# EAGLE design smallTransBrd (EAGLE 9.1.0)
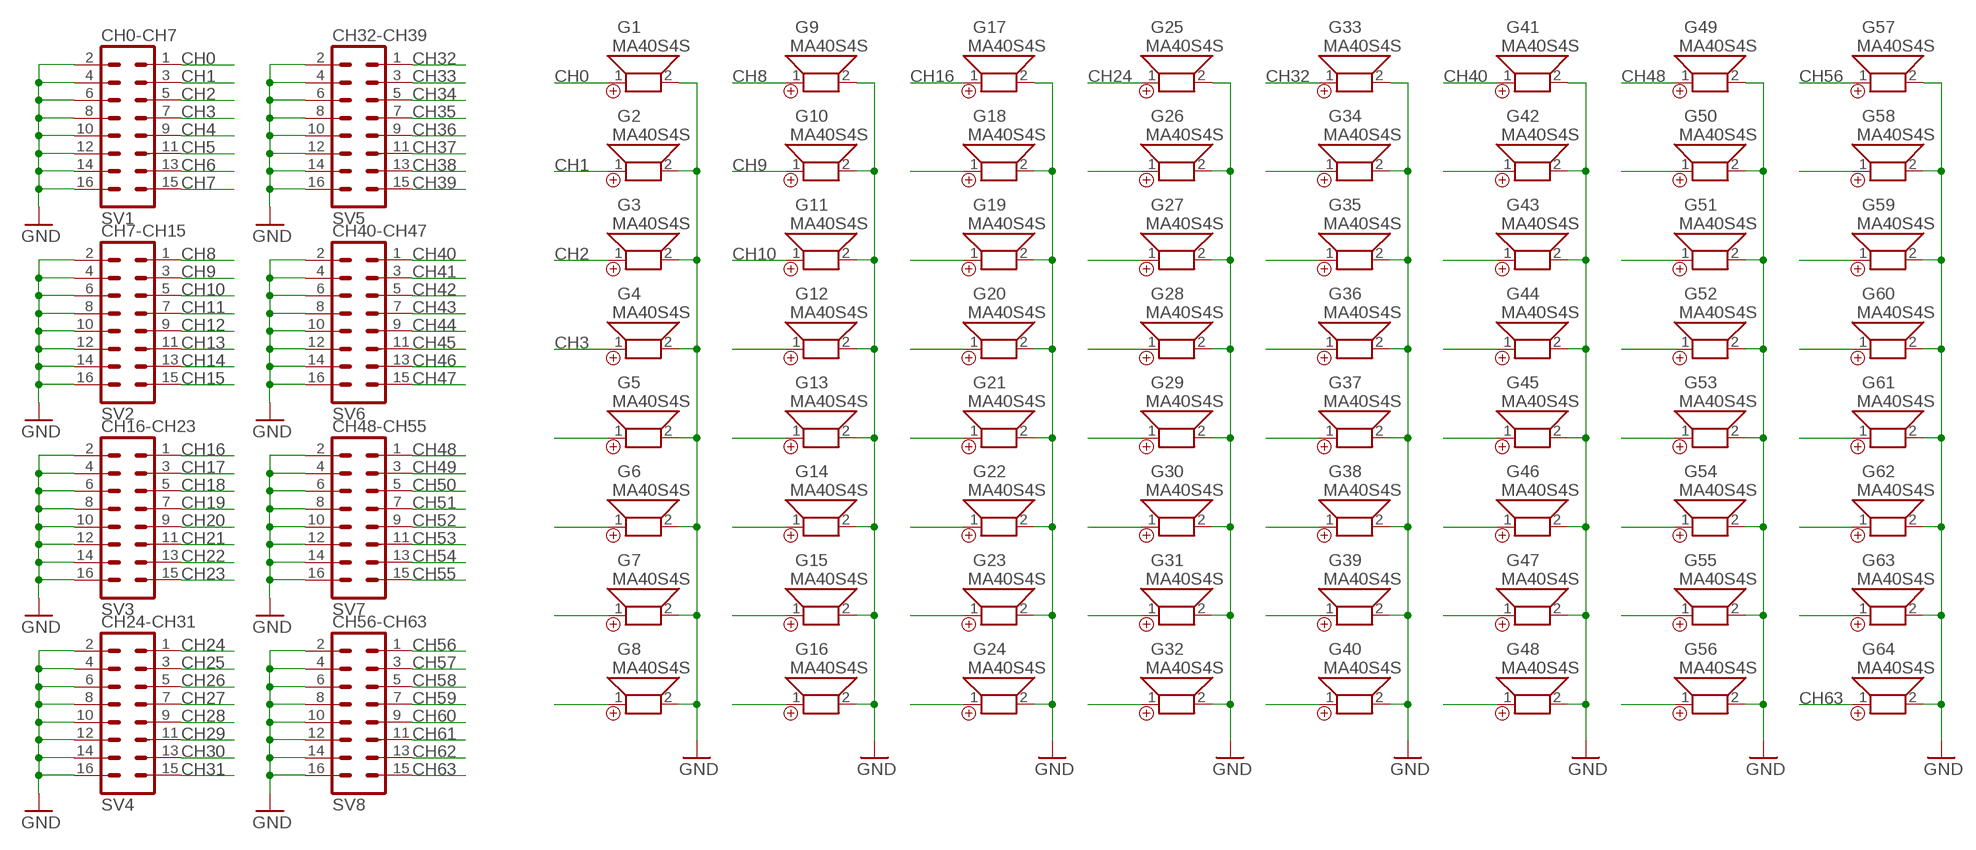
[diagram p0: schematic, sheet 1]

## Parts
G1  MA40S4S  [MA40S4S]
G2  MA40S4S  [MA40S4S]
G3  MA40S4S  [MA40S4S]
G4  MA40S4S  [MA40S4S]
G5  MA40S4S  [MA40S4S]
G6  MA40S4S  [MA40S4S]
G7  MA40S4S  [MA40S4S]
G8  MA40S4S  [MA40S4S]
G9  MA40S4S  [MA40S4S]
G10  MA40S4S  [MA40S4S]
G11  MA40S4S  [MA40S4S]
G12  MA40S4S  [MA40S4S]
G13  MA40S4S  [MA40S4S]
G14  MA40S4S  [MA40S4S]
G15  MA40S4S  [MA40S4S]
G16  MA40S4S  [MA40S4S]
G17  MA40S4S  [MA40S4S]
G18  MA40S4S  [MA40S4S]
G19  MA40S4S  [MA40S4S]
G20  MA40S4S  [MA40S4S]
G21  MA40S4S  [MA40S4S]
G22  MA40S4S  [MA40S4S]
G23  MA40S4S  [MA40S4S]
G24  MA40S4S  [MA40S4S]
G25  MA40S4S  [MA40S4S]
G26  MA40S4S  [MA40S4S]
G27  MA40S4S  [MA40S4S]
G28  MA40S4S  [MA40S4S]
G29  MA40S4S  [MA40S4S]
G30  MA40S4S  [MA40S4S]
G31  MA40S4S  [MA40S4S]
G32  MA40S4S  [MA40S4S]
G33  MA40S4S  [MA40S4S]
G34  MA40S4S  [MA40S4S]
G35  MA40S4S  [MA40S4S]
G36  MA40S4S  [MA40S4S]
G37  MA40S4S  [MA40S4S]
G38  MA40S4S  [MA40S4S]
G39  MA40S4S  [MA40S4S]
G40  MA40S4S  [MA40S4S]
G41  MA40S4S  [MA40S4S]
G42  MA40S4S  [MA40S4S]
G43  MA40S4S  [MA40S4S]
G44  MA40S4S  [MA40S4S]
G45  MA40S4S  [MA40S4S]
G46  MA40S4S  [MA40S4S]
G47  MA40S4S  [MA40S4S]
G48  MA40S4S  [MA40S4S]
G49  MA40S4S  [MA40S4S]
G50  MA40S4S  [MA40S4S]
G51  MA40S4S  [MA40S4S]
G52  MA40S4S  [MA40S4S]
G53  MA40S4S  [MA40S4S]
G54  MA40S4S  [MA40S4S]
G55  MA40S4S  [MA40S4S]
G56  MA40S4S  [MA40S4S]
G57  MA40S4S  [MA40S4S]
G58  MA40S4S  [MA40S4S]
G59  MA40S4S  [MA40S4S]
G60  MA40S4S  [MA40S4S]
G61  MA40S4S  [MA40S4S]
G62  MA40S4S  [MA40S4S]
G63  MA40S4S  [MA40S4S]
G64  MA40S4S  [MA40S4S]
SV1  CH0-CH7  ML16  [ML16]
SV2  CH7-CH15  ML16  [ML16]
SV3  CH16-CH23  ML16  [ML16]
SV4  CH24-CH31  ML16  [ML16]
SV5  CH32-CH39  ML16  [ML16]
SV6  CH40-CH47  ML16  [ML16]
SV7  CH48-CH55  ML16  [ML16]
SV8  CH56-CH63  ML16  [ML16]

## Nets
CH0: G1.1 SV1.1
CH1: G2.1 SV1.3
CH2: G3.1 SV1.5
CH3: G4.1 SV1.7
CH4: G5.1 SV1.9
CH5: G6.1 SV1.11
CH6: G7.1 SV1.13
CH7: G8.1 SV1.15
CH8: G9.1 SV2.1
CH9: G10.1 SV2.3
CH10: G11.1 SV2.5
CH11: G12.1 SV2.7
CH12: G13.1 SV2.9
CH13: G14.1 SV2.11
CH14: G15.1 SV2.13
CH15: G16.1 SV2.15
CH16: G17.1 SV3.1
CH17: G18.1 SV3.3
CH18: G19.1 SV3.5
CH19: G20.1 SV3.7
CH20: G21.1 SV3.9
CH21: G22.1 SV3.11
CH22: G23.1 SV3.13
CH23: G24.1 SV3.15
CH24: G25.1 SV4.1
CH25: G26.1 SV4.3
CH26: G27.1 SV4.5
CH27: G28.1 SV4.7
CH28: G29.1 SV4.9
CH29: G30.1 SV4.11
CH30: G31.1 SV4.13
CH31: G32.1 SV4.15
CH32: G33.1 SV5.1
CH33: G34.1 SV5.3
CH34: G35.1 SV5.5
CH35: G36.1 SV5.7
CH36: G37.1 SV5.9
CH37: G38.1 SV5.11
CH38: G39.1 SV5.13
CH39: G40.1 SV5.15
CH40: G41.1 SV6.1
CH41: G42.1 SV6.3
CH42: G43.1 SV6.5
CH43: G44.1 SV6.7
CH44: G45.1 SV6.9
CH45: G46.1 SV6.11
CH46: G47.1 SV6.13
CH47: G48.1 SV6.15
CH48: G49.1 SV7.1
CH49: G50.1 SV7.3
CH50: G51.1 SV7.5
CH51: G52.1 SV7.7
CH52: G53.1 SV7.9
CH53: G54.1 SV7.11
CH54: G55.1 SV7.13
CH55: G56.1 SV7.15
CH56: G57.1 SV8.1
CH57: G58.1 SV8.3
CH58: G59.1 SV8.5
CH59: G60.1 SV8.7
CH60: G61.1 SV8.9
CH61: G62.1 SV8.11
CH62: G63.1 SV8.13
CH63: G64.1 SV8.15
GND: G1.2 G2.2 G3.2 G4.2 G5.2 G6.2 G7.2 G8.2 G9.2 G10.2 G11.2 G12.2 G13.2 G14.2 G15.2 G16.2 G17.2 G18.2 G19.2 G20.2 G21.2 G22.2 G23.2 G24.2 G25.2 G26.2 G27.2 G28.2 G29.2 G30.2 G31.2 G32.2 G33.2 G34.2 G35.2 G36.2 G37.2 G38.2 G39.2 G40.2 G41.2 G42.2 G43.2 G44.2 G45.2 G46.2 G47.2 G48.2 G49.2 G50.2 G51.2 G52.2 G53.2 G54.2 G55.2 G56.2 G57.2 G58.2 G59.2 G60.2 G61.2 G62.2 G63.2 G64.2 SV1.2 SV1.4 SV1.6 SV1.8 SV1.10 SV1.12 SV1.14 SV1.16 SV2.2 SV2.4 SV2.6 SV2.8 SV2.10 SV2.12 SV2.14 SV2.16 SV3.2 SV3.4 SV3.6 SV3.8 SV3.10 SV3.12 SV3.14 SV3.16 SV4.2 SV4.4 SV4.6 SV4.8 SV4.10 SV4.12 SV4.14 SV4.16 SV5.2 SV5.4 SV5.6 SV5.8 SV5.10 SV5.12 SV5.14 SV5.16 SV6.2 SV6.4 SV6.6 SV6.8 SV6.10 SV6.12 SV6.14 SV6.16 SV7.2 SV7.4 SV7.6 SV7.8 SV7.10 SV7.12 SV7.14 SV7.16 SV8.2 SV8.4 SV8.6 SV8.8 SV8.10 SV8.12 SV8.14 SV8.16

## Library data of the parts
G1-G64 = projectLib:MA40S4S
SV1-SV8 = con-harting-ml:ML16: HARTING; OC_FARNELL: unknown; OC_NEWARK: unknown

## Board
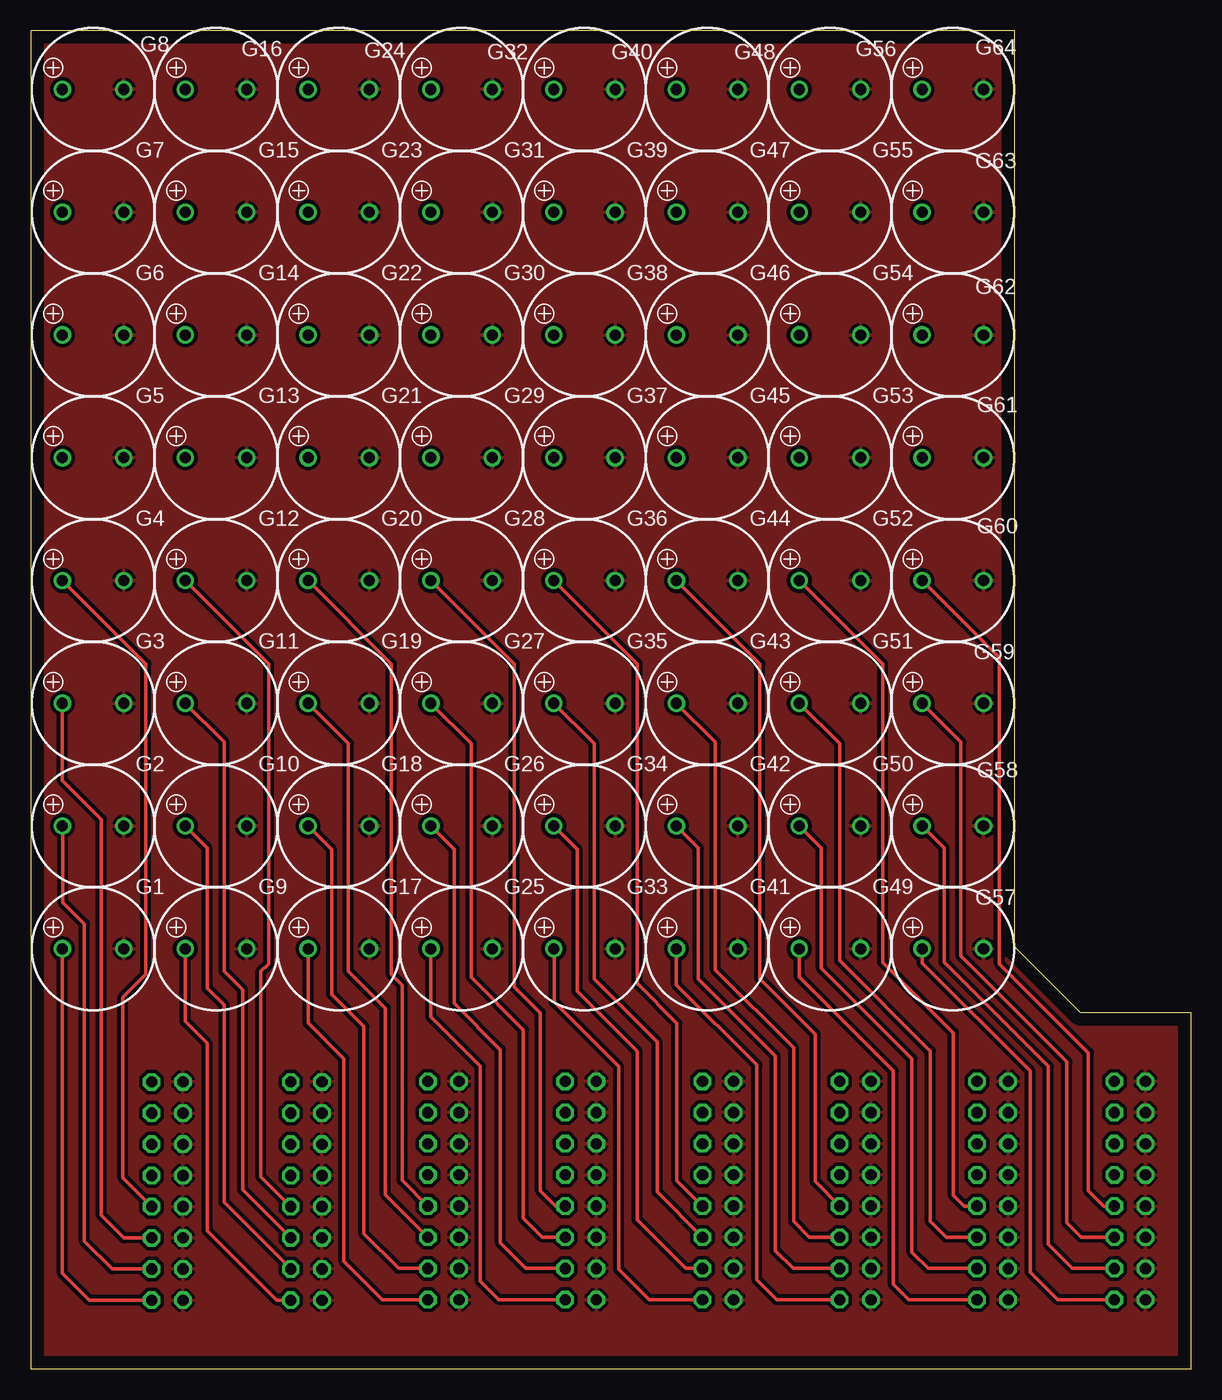
[diagram p1: board, top side]
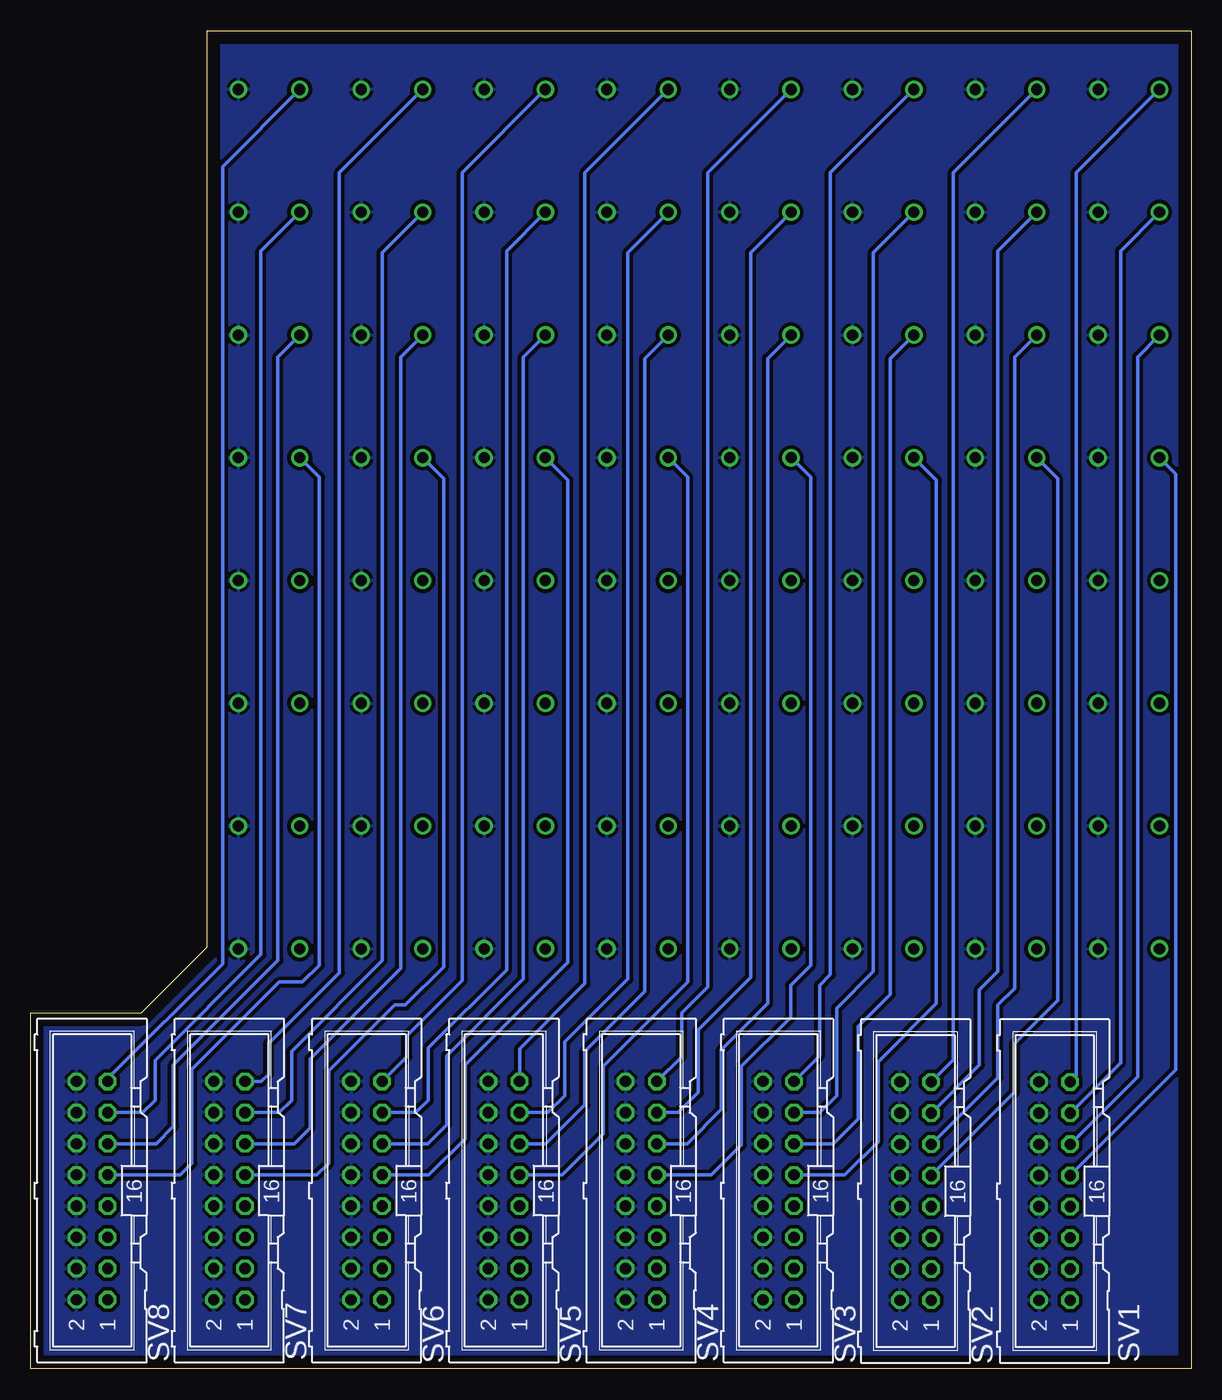
[diagram p2: board, bottom side, seen from below]

Size 94.5 x 109 mm. Coordinates in mm from the lower left corner, seen from the top.
Outline: 0,0 94.5,0 94.5,29 85.5,29 80.12,34.38 80.12,43.38 80.12,109 0,109 0,0
Copper layers (1*16): Top 0.035mm / dielectric 1.5mm / Bottom 0.035mm
Design rules "default *": minimum track width 6mil, minimum drill 0.35mm, track to track 12mil, track to pad 12mil, pad to pad 12mil, via to via 12mil, smd to smd 12mil, copper to edge 40mil, drill to drill 6mil, minimum pad ring 10mil, minimum via ring 8mil, stop-mask expansion 4mil, vias tented up to drill 0mil, thermal gap 10mil

### Footprints (pad centres in the part's own frame; a part is rotated, then mirrored left to right if it is on the bottom)
MA40S4S = drill 0.9: 1 -2.5,0; 2 2.5,0
ML16 = drill 0.914 octagon: 1 -8.89,-1.27; 2 -8.89,1.27; 3 -6.35,-1.27; 4 -6.35,1.27; 5 -3.81,-1.27; 6 -3.81,1.27; 7 -1.27,-1.27; 8 -1.27,1.27; 9 1.27,-1.27; 10 1.27,1.27; 11 3.81,-1.27; 12 3.81,1.27; 13 6.35,-1.27; 14 6.35,1.27; 15 8.89,-1.27; 16 8.89,1.27

### Placement (x,y rotation side)
G1  5.08,34.21 0 top
G2  5.08,44.21 0 top
G3  5.08,54.21 0 top
G4  5.08,64.21 0 top
G5  5.08,74.21 0 top
G6  5.08,84.21 0 top
G7  5.08,94.21 0 top
G8  5.08,104.21 0 top
G9  15.08,34.21 0 top
G10  15.08,44.21 0 top
G11  15.08,54.21 0 top
G12  15.08,64.21 0 top
G13  15.08,74.21 0 top
G14  15.08,84.21 0 top
G15  15.08,94.21 0 top
G16  15.08,104.21 0 top
G17  25.08,34.21 0 top
G18  25.08,44.21 0 top
G19  25.08,54.21 0 top
G20  25.08,64.21 0 top
G21  25.08,74.21 0 top
G22  25.08,84.21 0 top
G23  25.08,94.21 0 top
G24  25.08,104.21 0 top
G25  35.08,34.21 0 top
G26  35.08,44.21 0 top
G27  35.08,54.21 0 top
G28  35.08,64.21 0 top
G29  35.08,74.21 0 top
G30  35.08,84.21 0 top
G31  35.08,94.21 0 top
G32  35.08,104.21 0 top
G33  45.08,34.21 0 top
G34  45.08,44.21 0 top
G35  45.08,54.21 0 top
G36  45.08,64.21 0 top
G37  45.08,74.21 0 top
G38  45.08,84.21 0 top
G39  45.08,94.21 0 top
G40  45.08,104.21 0 top
G41  55.08,34.21 0 top
G42  55.08,44.21 0 top
G43  55.08,54.21 0 top
G44  55.08,64.21 0 top
G45  55.08,74.21 0 top
G46  55.08,84.21 0 top
G47  55.08,94.21 0 top
G48  55.08,104.21 0 top
G49  65.08,34.21 0 top
G50  65.08,44.21 0 top
G51  65.08,54.21 0 top
G52  65.08,64.21 0 top
G53  65.08,74.21 0 top
G54  65.08,84.21 0 top
G55  65.08,94.21 0 top
G56  65.08,104.21 0 top
G57  75.08,34.21 0 top
G58  75.08,44.21 0 top
G59  75.08,54.21 0 top
G60  75.08,64.21 0 top
G61  75.08,74.21 0 top
G62  75.08,84.21 0 top
G63  75.08,94.21 0 top
G64  75.08,104.21 0 top
SV1  11.12,14.48 90 bottom
SV2  22.45,14.48 90 bottom
SV3  33.61,14.52 90 bottom
SV4  44.79,14.52 90 bottom
SV5  55.97,14.52 90 bottom
SV6  67.15,14.52 90 bottom
SV7  78.33,14.52 90 bottom
SV8  89.5,14.52 90 bottom

### Tracks (layer width: path | path; a pad name or v marks a point on that pad's centre or on a via)
CH0
  Top 0.3: SV1.1 4.79,5.59 2.58,7.79 G1.1
CH1
  Top 0.3: SV1.3 6.62,8.13 4.38,10.38 4.38,36.25 2.62,38 2.62,44.17 G2.1
CH2
  Top 0.3: SV1.5 7.58,10.67 5.75,12.5 5.75,44.75 2.58,47.92 G3.1
CH3
  Top 0.3: SV1.7 7.5,15.56 7.5,30.25 9.38,32.12 9.38,57.42 G4.1
CH4
  Bottom 0.3: SV1.9 1.25,24.35 1.25,72.88 G5.1
CH5
  Bottom 0.3: SV1.11 4.38,23.77 4.38,82.42 G6.1
CH6
  Bottom 0.3: SV1.13 5.75,24.93 5.75,91.05 G7.1
CH7
  Bottom 0.3: SV1.15 9.38,23.85 9.38,97.42 G8.1
CH8
  Top 0.3: SV2.1 20.04,5.59 14.38,11.25 14.38,26.5 12.58,28.29 G9.1
CH9
  Top 0.3: SV2.3 15.75,13.55 15.75,29.62 14.38,31 14.38,42.42 G10.1
CH10
  Top 0.3: SV2.5 17.25,14.59 17.25,30.88 15.75,32.38 15.75,51.05 G11.1
CH11
  Top 0.3: SV2.7 18.75,15.63 18.75,32.38 19.38,33 19.38,57.42 G12.1
CH12
  Bottom 0.3: SV2.9 14.38,22.55 14.38,26.5 10.88,30 10.88,72.5 G13.1
CH13
  Bottom 0.3: SV2.11 15.75,23.71 15.75,29.62 14.38,31 14.38,82.42 G14.1
CH14
  Bottom 0.3: SV2.13 17.25,24.75 17.25,30.88 15.75,32.38 15.75,91.05 G15.1
CH15
  Bottom 0.3: SV2.15 19.38,25.17 19.38,97.42 G16.1
CH16
  Top 0.3: SV3.1 28.62,5.63 25.5,8.75 25.5,25.25 22.58,28.17 G17.1
CH17
  Top 0.3: SV3.3 29.95,8.17 27.12,11 27.12,27.88 24.5,30.5 24.5,42.3 G18.1
CH18
  Top 0.3: SV3.5 28.88,14.18 28.88,29.38 25.88,32.38 25.88,50.92 G19.1
CH19
  Top 0.3: SV3.7 30.25,15.34 30.25,31.25 29.5,32 29.38,32.12 29.38,57.42 G20.1
CH20
  Bottom 0.3: SV3.9 28.21,15.79 25.5,18.5 25.5,25 20.75,29.75 20.75,72.38 G21.1
CH21
  Bottom 0.3: SV3.11 29.17,18.33 27.12,20.38 27.12,27.88 24.5,30.5 24.5,82.3 G22.1
CH22
  Bottom 0.3: SV3.13 30.25,20.87 28.88,22.25 28.88,29.38 25.88,32.38 25.88,90.92 G23.1
CH23
  Bottom 0.3: SV3.15 30.25,25.5 30.25,31.25 29.38,32.12 29.38,97.42 G24.1
CH24
  Top 0.3: SV4.1 38.12,5.63 36.62,7.12 36.62,24.62 32.58,28.67 G25.1
CH25
  Top 0.3: SV4.3 40.33,8.17 38.25,10.25 38.25,17.38 38.25,26 34.5,29.75 34.5,42.3 G26.1
CH26
  Top 0.3: SV4.5 41.66,10.71 40.12,12.25 40.12,27.62 35.88,31.88 35.88,50.92 G27.1
CH27
  Top 0.3: SV4.7 42.75,13.25 41.5,14.5 41.5,29 39.38,31.12 39.38,57.42 G28.1
CH28
  Bottom 0.3: SV4.9 39.08,15.79 36.62,18.25 36.62,24.62 32.62,28.62 32.62,31.25 31,32.88 31,72.63 G29.1
CH29
  Bottom 0.3: SV4.11 41.04,18.33 38.25,21.12 38.25,26 34.5,29.75 34.5,82.3 G30.1
CH30
  Bottom 0.3: SV4.13 41.75,20.87 40.12,22.5 40.12,27.62 35.88,31.88 35.88,90.92 G31.1
CH31
  Bottom 0.3: SV4.15 41.5,25.43 41.5,29 39.38,31.12 39.38,97.42 G32.1
CH32
  Top 0.3: SV5.1 50.37,5.63 47.88,8.12 47.88,24.62 42.62,29.88 42.62,34.17 G33.1
CH33
  Top 0.3: SV5.3 53.33,8.17 49.38,12.12 49.38,25.88 44.5,30.75 44.5,42.3 G34.1
CH34
  Top 0.3: SV5.5 51,14.41 51,26.62 45.88,31.75 45.88,50.92 G35.1
CH35
  Top 0.3: SV5.7 52.62,15.32 52.62,28.12 49.38,31.38 49.38,57.42 G36.1
CH36
  Bottom 0.3: SV5.9 51.21,15.79 47.88,19.12 47.88,24.62 41,31.5 41,72.63 G37.1
CH37
  Bottom 0.3: SV5.11 52.54,18.33 49.38,21.5 49.38,25.88 44.5,30.75 44.5,82.3 G38.1
CH38
  Bottom 0.3: SV5.13 52.38,20.87 51,22.25 51,26.62 45.88,31.75 45.88,90.92 G39.1
CH39
  Bottom 0.3: SV5.15 54.7,26.05 49.38,31.38 49.38,97.42 G40.1
CH40
  Top 0.3: SV6.1 60.74,5.63 59.12,7.25 59.12,24.75 52.58,31.29 G41.1
CH41
  Top 0.3: SV6.3 62.08,8.17 60.62,9.62 60.62,25.5 54.38,31.75 54.38,42.42 G42.1
CH42
  Top 0.3: SV6.5 63.41,10.71 62.12,12 62.12,26.12 55.75,32.5 55.75,51.05 G43.1
CH43
  Top 0.3: SV6.7 63.88,15.25 63.88,27.25 59.38,31.75 59.38,57.42 G44.1
CH44
  Bottom 0.3: SV6.9 62.08,15.79 59.12,18.75 59.12,24.75 50.75,33.12 50.75,72.38 G45.1
CH45
  Bottom 0.3: SV6.11 62.17,18.33 60.62,19.88 60.62,25.5 54.38,31.75 54.38,82.42 G46.1
CH46
  Bottom 0.3: SV6.13 63.13,20.87 62.12,21.88 62.12,26.12 55.75,32.5 55.75,91.05 G47.1
CH47
  Bottom 0.3: SV6.15 63.88,25.41 63.88,27.12 59.38,31.62 59.38,97.42 G48.1
CH48
  Top 0.3: SV7.1 71.49,5.63 70.25,6.88 70.25,24.25 62.58,31.92 G49.1
CH49
  Top 0.3: SV7.3 73.08,8.17 71.75,9.5 71.75,25.25 64.38,32.62 64.38,42.42 G50.1
CH50
  Top 0.3: SV7.5 74.54,10.71 73.25,12 73.25,25.88 65.88,33.25 65.88,50.92 G51.1
CH51
  Top 0.3: SV7.7 76,13.25 75.12,14.12 75.12,27.38 69.38,33.12 69.38,57.42 G52.1
CH52
  Bottom 0.3: SV7.9 71.21,15.79 70.25,16.75 70.25,24.25 64.88,29.62 64,29.62 60.88,32.75 60.88,72.5 G53.1
CH53
  Bottom 0.3: SV7.11 73.04,18.33 71.75,19.62 71.75,25.25 64.38,32.62 64.38,82.42 G54.1
CH54
  Bottom 0.3: SV7.13 74.25,20.87 73.25,21.88 73.25,25.88 65.88,33.25 65.88,90.92 G55.1
CH55
  Bottom 0.3: SV7.15 75.71,23.41 75.12,24 75.12,26.5 69.38,32.25 69.38,97.42 G56.1
CH56
  Top 0.3: SV8.1 83.62,5.63 81.38,7.88 81.38,24.25 72.58,33.04 G57.1
CH57
  Top 0.3: SV8.3 84.83,8.17 82.88,10.12 | 82.88,10.12 | 82.88,10.12 82.88,24.62 74.38,33.12 74.38,42.42 G58.1
CH58
  Top 0.3: SV8.5 85.54,10.71 84.38,11.88 84.38,25 75.75,33.62 75.75,51.05 G59.1
CH59
  Top 0.3: SV8.7 87.37,13.25 86.12,14.5 86.12,25.75 78.88,33 78.88,57.92 G60.1
CH60
  Bottom 0.3: SV8.9 82.33,15.79 81.38,16.75 81.38,24.38 74.25,31.5 72.38,31.5 71,32.88 71,72.63 G61.1
CH61
  Bottom 0.3: SV8.11 84.29,18.33 82.88,19.75 82.88,24.75 74.38,33.25 74.38,82.42 G62.1
CH62
  Bottom 0.3: SV8.13 85.38,20.87 84.38,21.88 84.38,25.12 75.75,33.75 75.75,91.05 G63.1
CH63
  Bottom 0.3: SV8.15 88.23,23.64 78.88,33 78.88,97.92 G64.1
GND
  pour Top: -0.25,0 94.91,0 94.91,109.12 -0.25,109.12
  pour Bottom: 0,0 94.88,0 94.88,109 0,109